# Altium schematic sheet cSLIM-SA_nRF9160.SchDoc: cSLIM v1 - nRF9160
size A3; SheetNumber: 2; SheetTotal: 12; Size: A3
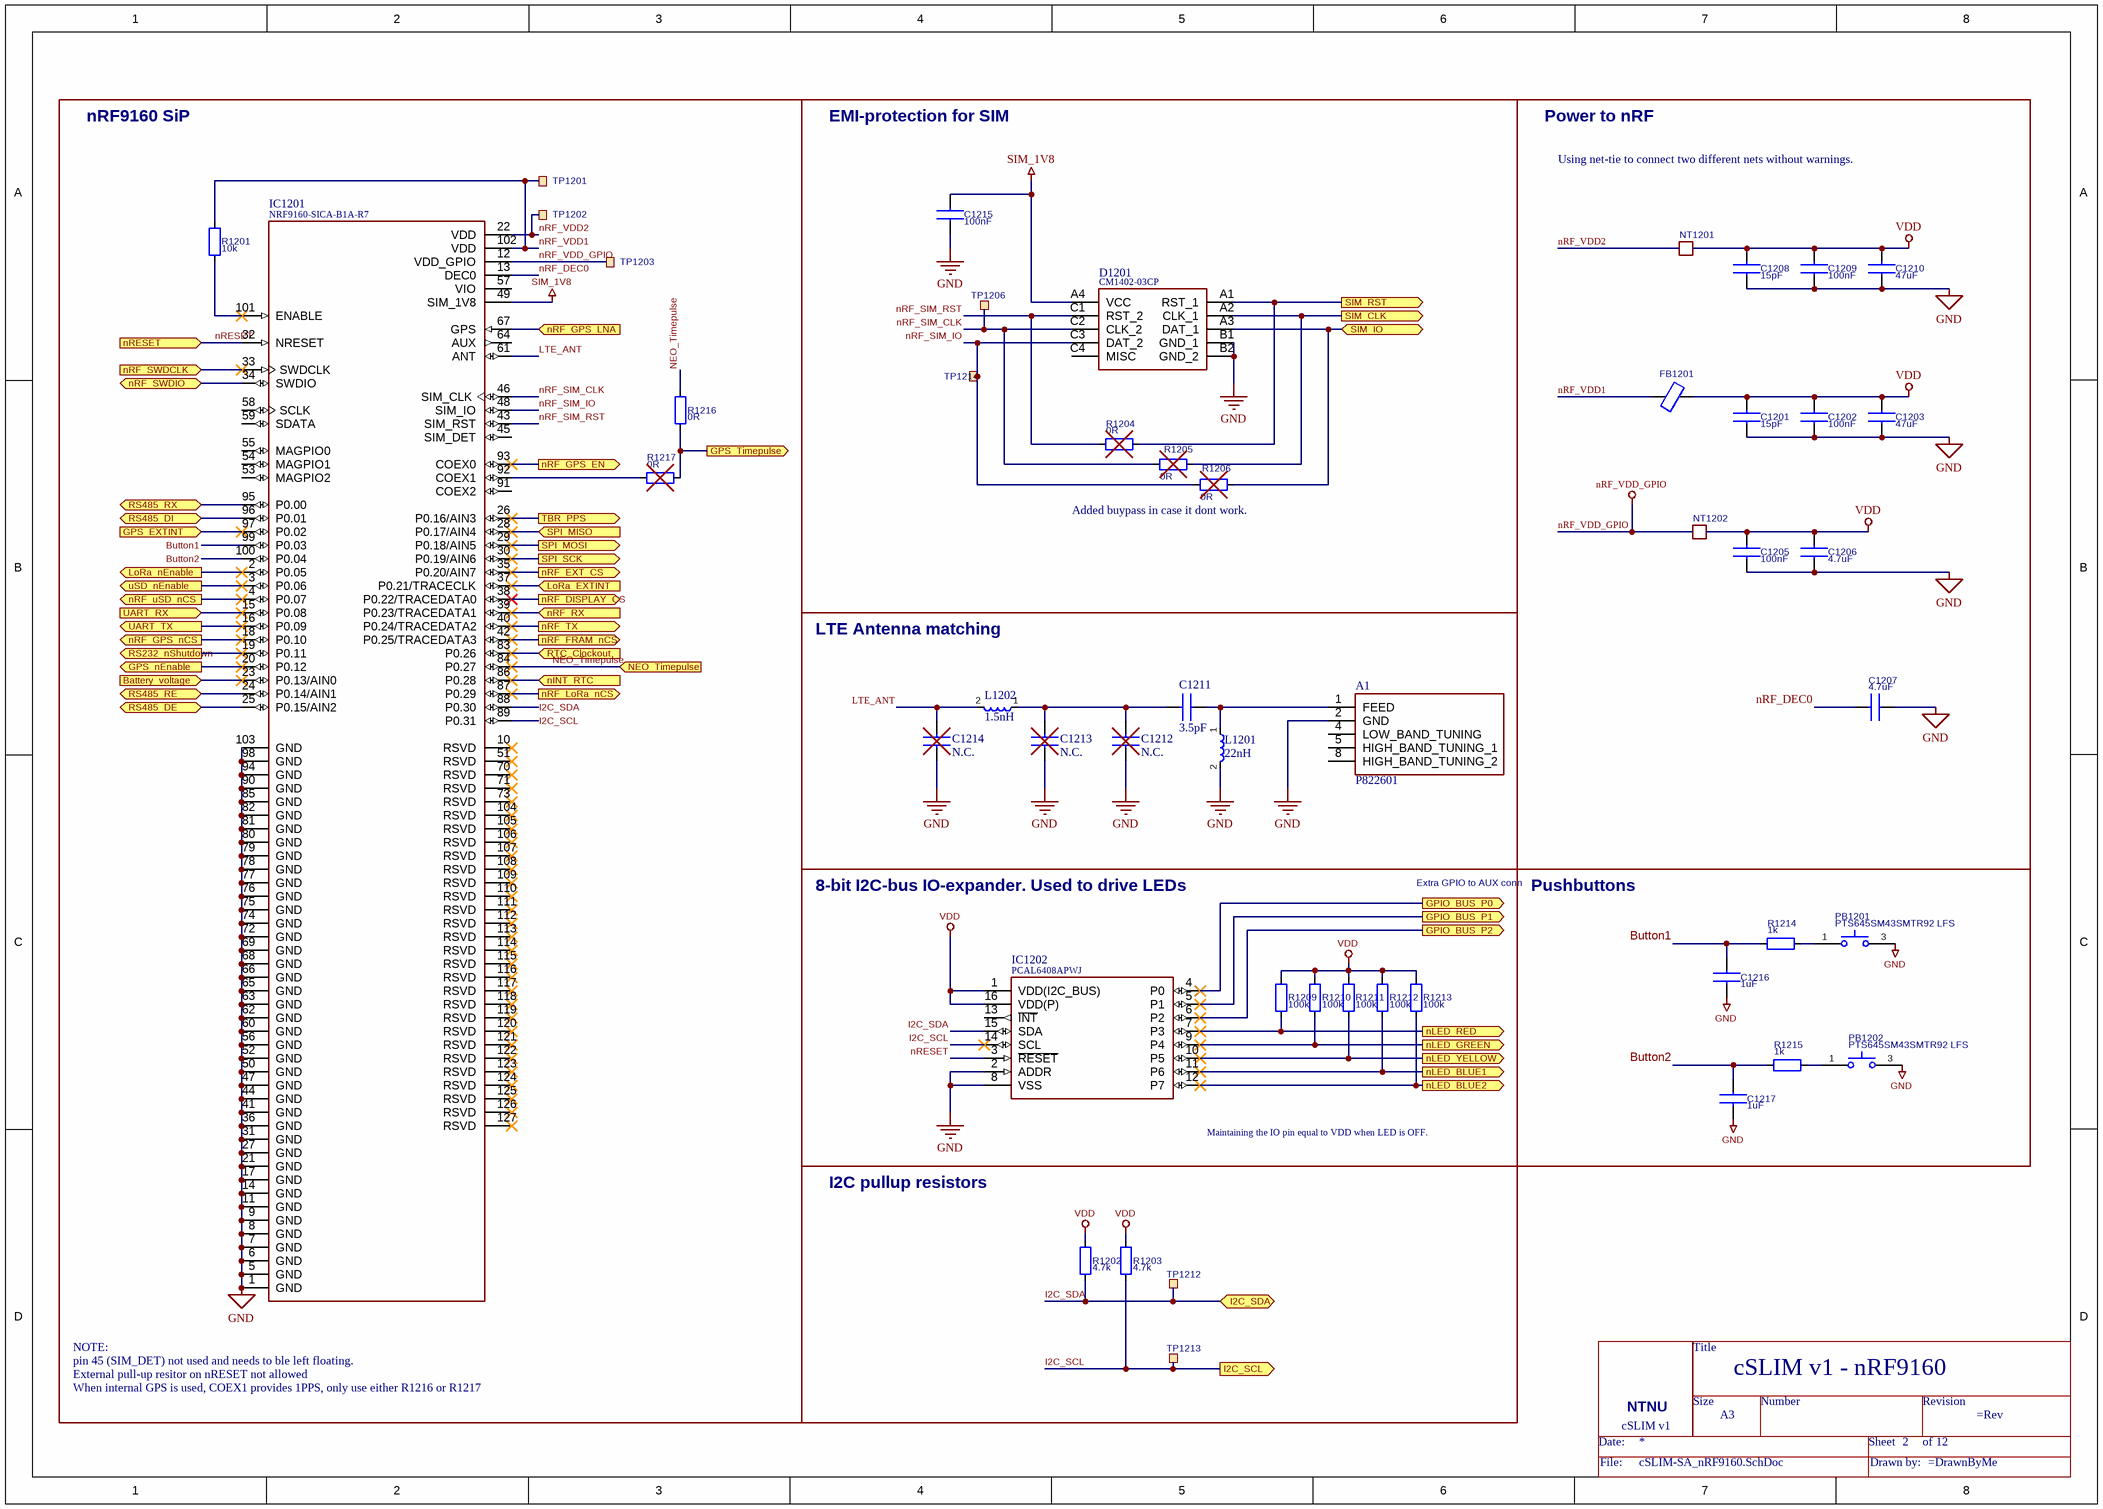
[diagram p0: cSLIM-SA_nRF9160.SchDoc]

## Parts
=DocumentName  Title_block  (value not drawn)  (no BOM)
A1  P822601  [P822601]
C1201  15pF  [CAPC1608X90N]
C1202  100nF  [CAPC1608X90N]
C1203  47uF  [CAPC1608X90N]
C1205  100nF  [CAPC1608X90N]
C1206  4.7uF  [CAPC1608X90N]
C1207  4.7uF  [CAPC1608X90N]
C1208  15pF  [CAPC1608X90N]
C1209  100nF  [CAPC1608X90N]
C1210  47uF  [CAPC1608X90N]
C1211  3.5pF  [CAPC1608X90N]
C1212  N.C.  [CAPC1608X90N]
C1213  N.C.  [CAPC1608X90N]
C1214  N.C.  [CAPC1608X90N]
C1215  100nF  [CAPC1608X90N]
C1216  1uF  [CAPC1608X90N]
C1217  1uF  [CAPC1608X90N]
D1201  CM1402-03CP  [CM140203CP]
FB1201  BLM18AG121SH1D  [CAPC1608X90N]  (value not drawn)
IC1201  NRF9160-SICA-B1A-R7  [XCVR_NRF9160-SICA-R7]
IC1202  PCAL6408APWJ  [SOP65P640X110-16N]
L1201  22nH  [L-1608]
L1202  1.5nH  [L-1608]
NT1201  NetTie  [NETTIE_FP]  (value not drawn)  (no BOM)
NT1202  NetTie  [NETTIE_FP]  (value not drawn)  (no BOM)
PB1201  PTS645SM43SMTR92 LFS  [PTS645(SMT)]
PB1202  PTS645SM43SMTR92 LFS  [PTS645(SMT)]
R1201  10k  [RESC1608X55N]
R1202  4.7k  [RESC1608X55N]
R1203  4.7k  [RESC1608X55N]
R1204  0R  [RESC1608X55N]
R1205  0R  [RESC1608X55N]
R1206  0R  [RESC1608X55N]
R1209  100k  [RESC1608X55N]
R1210  100k  [RESC1608X55N]
R1211  100k  [RESC1608X55N]
R1212  100k  [RESC1608X55N]
R1213  100k  [RESC1608X55N]
R1214  1k  [RESC1608X55N]
R1215  1k  [RESC1608X55N]
R1216  0R  [RESC1608X55N]
R1217  0R  [RESC1608X55N]
TP1201  TP  [TP_SMD_Ø1.0mm]  (value not drawn)  (no BOM)
TP1202  TP  [TP_SMD_Ø1.0mm]  (value not drawn)  (no BOM)
TP1203  TP  [TP_SMD_Ø1.0mm]  (value not drawn)  (no BOM)
TP1206  TP  [TP_SMD_Ø1.0mm]  (value not drawn)  (no BOM)
TP1212  TP  [TP_SMD_Ø1.0mm]  (value not drawn)  (no BOM)
TP1213  TP  [TP_SMD_Ø1.0mm]  (value not drawn)  (no BOM)
TP1214  TP  [TP_SMD_Ø1.0mm]  (value not drawn)  (no BOM)

## Blocks framed on the sheet
nRF9160 SiP: IC1201 R1201 R1216 R1217 TP1201-TP1203
EMI-protection for SIM: C1215 D1201 R1204-R1206 TP1206 TP1214
Power to nRF: C1201-C1203 C1205-C1210 FB1201 NT1201 NT1202
LTE Antenna matching: A1 C1211-C1214 L1201 L1202
8-bit I2C-bus IO-expander. Used to drive LEDs: IC1202 R1209-R1213
Pushbuttons: C1216 C1217 PB1201 PB1202 R1214 R1215
I2C pullup resistors: R1202 R1203 TP1212 TP1213

## Ports
Battery_voltage (in), GPIO_BUS_P0 (out), GPIO_BUS_P1 (out), GPIO_BUS_P2 (out), GPS_EXTINT (in), GPS_nEnable (out), GPS_Timepulse (out), I2C_SCL (out), I2C_SDA (bidir), LoRa_EXTINT (in), LoRa_nEnable (out), NEO_Timepulse (in), nINT_RTC (in), nLED_BLUE1 (out), nLED_BLUE2 (out), nLED_GREEN (out), nLED_RED (out), nLED_YELLOW (out), nRESET (in), nRF_DISPLAY_CS (out), nRF_EXT_CS (out), nRF_FRAM_nCS (out), nRF_GPS_EN (out), nRF_GPS_LNA (in), nRF_GPS_nCS (out), nRF_LoRa_nCS (out), nRF_RX (in), nRF_SWDCLK (in), nRF_SWDIO (bidir), nRF_TX (out), nRF_uSD_nCS (out), RS232_nShutdown (out), RS485_DE (bidir), RS485_DI (bidir), RS485_RE (bidir), RS485_RX (bidir), RTC_Clockout (in), SIM_CLK (out), SIM_IO (bidir), SIM_RST (out), SPI_MISO (in), SPI_MOSI (out), SPI_SCK (out), TBR_PPS (out), UART_RX (in), UART_TX (out), uSD_nEnable (out)

## Nets
GND: A1.2(GND) C1201.2 C1202.2 C1203.2 C1205.2 C1206.2 C1207.2 C1208.2 C1209.2 C1210.2 C1212.2 C1213.2 C1214.2 C1215.2 C1216.2 C1217.2 D1201.B1(GND_1) D1201.B2(GND_2) IC1201.1(GND) IC1201.5(GND) IC1201.6(GND) IC1201.7(GND) IC1201.8(GND) IC1201.9(GND) IC1201.11(GND) IC1201.14(GND) IC1201.17(GND) IC1201.21(GND) IC1201.27(GND) IC1201.31(GND) IC1201.36(GND) IC1201.41(GND) IC1201.44(GND) IC1201.47(GND) IC1201.50(GND) IC1201.52(GND) IC1201.56(GND) IC1201.60(GND) IC1201.62(GND) IC1201.63(GND) IC1201.65(GND) IC1201.66(GND) IC1201.68(GND) IC1201.69(GND) IC1201.72(GND) IC1201.74(GND) IC1201.75(GND) IC1201.76(GND) IC1201.77(GND) IC1201.78(GND) IC1201.79(GND) IC1201.80(GND) IC1201.81(GND) IC1201.82(GND) IC1201.85(GND) IC1201.90(GND) IC1201.94(GND) IC1201.98(GND) IC1201.103(GND) IC1202.2(ADDR) IC1202.8(VSS) L1201.2 PB1201.3 PB1202.3
nRF_VDD_GPIO: IC1201.12(VDD_GPIO) NT1202.1 TP1203.1
SIM_1V8: C1215.1 D1201.A4(VCC) IC1201.49(SIM_1V8)
VDD: C1201.1 C1202.1 C1203.1 C1205.1 C1206.1 C1208.1 C1209.1 C1210.1 FB1201.2 IC1202.1(VDD(I2C_BUS)) IC1202.16(VDD(P)) NT1201.2 NT1202.2 R1202.2 R1203.2 R1209.1 R1210.1 R1211.1 R1212.1 R1213.1
Battery_voltage: IC1201.23(P0.13/AIN0) ; port Battery_voltage
Button1: C1216.1 IC1201.99(P0.03) R1214.1
Button2: C1217.1 IC1201.100(P0.04) R1215.1
GPIO_BUS_P0: IC1202.4(P0) ; port GPIO_BUS_P0
GPIO_BUS_P1: IC1202.5(P1) ; port GPIO_BUS_P1
GPIO_BUS_P2: IC1202.6(P2) ; port GPIO_BUS_P2
GPS_EXTINT: IC1201.97(P0.02) ; port GPS_EXTINT
GPS_nEnable: IC1201.20(P0.12) ; port GPS_nEnable
GPS_Timepulse: R1216.2 R1217.2 ; port GPS_Timepulse
I2C_SCL: IC1201.89(P0.31) IC1202.14(SCL) R1203.1 TP1213.1 ; port I2C_SCL
I2C_SDA: IC1201.88(P0.30) IC1202.15(SDA) R1202.1 TP1212.1 ; port I2C_SDA
LoRa_EXTINT: IC1201.37(P0.21/TRACECLK) ; port LoRa_EXTINT
LoRa_nEnable: IC1201.2(P0.05) ; port LoRa_nEnable
LTE_ANT: C1214.1 IC1201.61(ANT) L1202.2
NEO_Timepulse: IC1201.84(P0.27) R1216.1 ; port NEO_Timepulse
nINT_RTC: IC1201.86(P0.28) ; port nINT_RTC
nLED_BLUE1: IC1202.11(P6) R1212.2 ; port nLED_BLUE1
nLED_BLUE2: IC1202.12(P7) R1213.2 ; port nLED_BLUE2
nLED_GREEN: IC1202.9(P4) R1210.2 ; port nLED_GREEN
nLED_RED: IC1202.7(P3) R1209.2 ; port nLED_RED
nLED_YELLOW: IC1202.10(P5) R1211.2 ; port nLED_YELLOW
nRESET: IC1201.32(NRESET) IC1202.3(~{RESET}) ; port nRESET
nRF_DEC0: C1207.1 IC1201.13(DEC0)
nRF_DISPLAY_CS: IC1201.38(P0.22/TRACEDATA0) ; port nRF_DISPLAY_CS
nRF_EXT_CS: IC1201.35(P0.20/AIN7) ; port nRF_EXT_CS
nRF_FRAM_nCS: IC1201.42(P0.25/TRACEDATA3) ; port nRF_FRAM_nCS
nRF_GPS_EN: IC1201.93(COEX0) ; port nRF_GPS_EN
nRF_GPS_LNA: IC1201.67(GPS) ; port nRF_GPS_LNA
nRF_GPS_nCS: IC1201.18(P0.10) ; port nRF_GPS_nCS
nRF_LoRa_nCS: IC1201.87(P0.29) ; port nRF_LoRa_nCS
nRF_RX: IC1201.39(P0.23/TRACEDATA1) ; port nRF_RX
nRF_SIM_CLK: D1201.C2(CLK_2) IC1201.46(SIM_CLK) R1205.1 TP1206.1
nRF_SIM_IO: D1201.C3(DAT_2) IC1201.48(SIM_IO) R1206.1 TP1214.1
nRF_SIM_RST: D1201.C1(RST_2) IC1201.43(SIM_RST) R1204.1
nRF_SWDCLK: IC1201.33(SWDCLK) ; port nRF_SWDCLK
nRF_SWDIO: IC1201.34(SWDIO) ; port nRF_SWDIO
nRF_TX: IC1201.40(P0.24/TRACEDATA2) ; port nRF_TX
nRF_uSD_nCS: IC1201.4(P0.07) ; port nRF_uSD_nCS
nRF_VDD1: FB1201.1 IC1201.102(VDD) R1201.1 TP1201.1
nRF_VDD2: IC1201.22(VDD) NT1201.1 TP1202.1
RS232_nShutdown: IC1201.19(P0.11) ; port RS232_nShutdown
RS485_DE: IC1201.25(P0.15/AIN2) ; port RS485_DE
RS485_DI: IC1201.96(P0.01) ; port RS485_DI
RS485_RE: IC1201.24(P0.14/AIN1) ; port RS485_RE
RS485_RX: IC1201.95(P0.00) ; port RS485_RX
RTC_Clockout: IC1201.83(P0.26) ; port RTC_Clockout
SIM_CLK: D1201.A2(CLK_1) R1205.2 ; port SIM_CLK
SIM_IO: D1201.A3(DAT_1) R1206.2 ; port SIM_IO
SIM_RST: D1201.A1(RST_1) R1204.2 ; port SIM_RST
SPI_MISO: IC1201.28(P0.17/AIN4) ; port SPI_MISO
SPI_MOSI: IC1201.29(P0.18/AIN5) ; port SPI_MOSI
SPI_SCK: IC1201.30(P0.19/AIN6) ; port SPI_SCK
TBR_PPS: IC1201.26(P0.16/AIN3) ; port TBR_PPS
UART_RX: IC1201.15(P0.08) ; port UART_RX
UART_TX: IC1201.16(P0.09) ; port UART_TX
uSD_nEnable: IC1201.3(P0.06) ; port uSD_nEnable
NetA1_1: A1.1(FEED) C1211.2 L1201.1
NetC1211_1: C1211.1 C1212.1 C1213.1 L1202.1
NetIC1201_92: IC1201.92(COEX1) R1217.1
NetIC1201_101: IC1201.101(ENABLE) R1201.2
NetPB1201_1: PB1201.1 R1214.2
NetPB1202_1: PB1202.1 R1215.2

Not connected (* = marked no-connect by the designer): A1 4(LOW_BAND_TUNING) 5(HIGH_BAND_TUNING_1) 8(HIGH_BAND_TUNING_2); D1201 C4(MISC); IC1201 10(RSVD)* 45(SIM_DET) 51(RSVD)* 53(MAGPIO2) 54(MAGPIO1) 55(MAGPIO0) 57(VIO) 58(SCLK) 59(SDATA) 64(AUX) 70(RSVD)* 71(RSVD)* 73(RSVD)* 91(COEX2) 104(RSVD)* 105(RSVD)* 106(RSVD)* 107(RSVD)* 108(RSVD)* 109(RSVD)* 110(RSVD)* 111(RSVD)* 112(RSVD)* 113(RSVD)* 114(RSVD)* 115(RSVD)* 116(RSVD)* 117(RSVD)* 118(RSVD)* 119(RSVD)* 120(RSVD)* 121(RSVD)* 122(RSVD)* 123(RSVD)* 124(RSVD)* 125(RSVD)* 126(RSVD)* 127(RSVD)*; IC1202 13(~{INT})

## Notes on the sheet
- Using net-tie to connect two different nets without warnings.
- (near R1206) Added buypass in case it dont work.
- Extra GPIO to AUX conn
- Maintaining the IO pin equal to VDD when LED is OFF.
- NOTE:
- pin 45 (SIM_DET) not used and needs to ble left floating.
- External pull-up resitor on nRESET not allowed
- When internal GPS is used, COEX1 provides 1PPS, only use either R1216 or R1217
- THIS DOCUMENT AND THE DATA DISCLOSED HEREIN OR
- HEREWITH IS THE PROPERTY OF ALTIUM LIMITED AND MAY
- DWG NO:
- REVISION
- REV:
- DESCRIPTION
- DATE
- APPROVED
- BE FREELY DISTRIBUTED IN WHOLE. NO RIGHTS ARE
- RESERVED OR EXPRESS OR IMPLIED WARANTEE GIVEN.
- ENG:
- APPROVALS
- PROJECT
- DSN:
- CHK:
- REFERENCE DOCUMENTS
- PROJECT REVISION:
- TITLE
- DOCUMENT REVISION:
- DESIGN ITEM:
- BOM:
- FAB DWG:
- PCB DWG:
- ASSY DWG:
- SCALE:
- A3
- SIZE
- CAGE CODE
- FILE NAME
- DWG NO.
- SHEET
- OF
- REV
- (in symbol Title_block) Title; Size; Number; Revision; NTNU; cSLIM v1; Date:; Sheet; of; File:; Drawn by:

## Library data of the parts
A1 = P822601: 700MHz, 750MHz, 850MHz, 900MHz, 1.8GHz, 1.9GHz, 2.1GHz, 2.7GHz CDMA, DCS, EDGE, GPRS, GSM, HSDPA, LTE, PCS, UMTS, WCDMA Flat Bar RF Antenna; Manufacturer_Name: AVX; Datasheet Link: http://datasheets.avx.com/ethertronics/AVX-E_P822601-P822602.pdf; Height: 3.5mm; Manufacturer_Part_Number: P822601; Mouser Part Number: 581-P822601; Mouser Price/Stock: https://www.mouser.co.uk/ProductDetail/AVX/P822601?qs=vdi0iO8H4N0igrTLYxGIXg%3D%3D; Arrow Part Number: P822601; Arrow Price/Stock: https://www.arrow.com/en/products/p822601/avx?region=nac
C1201 C1208 = C: Capacitor; Manufacturer_Part_Number: CL10C150JB81PNC; Fitted: Yes; value: 15pF
C1202 C1205 C1209 C1215 = C: Capacitor; Manufacturer_Part_Number: CL10B104KB8NNNL; Fitted: Yes; value: 100nF
C1203 C1210 = C: Capacitor; Manufacturer_Part_Number: GRM188D70E476ME01D; Fitted: Yes; value: 47uF
C1206 C1207 = C: Capacitor; Manufacturer_Part_Number: CL10A475KQ8NNNC; Fitted: Yes; value: 4.7uF
C1211 = C: Capacitor; Manufacturer_Part_Number: CL10C3R3CB81PNC; Fitted: Yes; value: 3.5pF
C1212-C1214 = C: Capacitor; Fitted: No; Manufacturer_Part_Number: *; value: N.C.
C1216 C1217 = C: Capacitor; Manufacturer_Part_Number: CL10A105KO8NNNC; Fitted: Yes; value: 1uF
D1201 = CM1402-03CP: FILTER RC(PI) ESD SMD; Manufacturer_Name: ON Semiconductor; Fitted: Yes; Datasheet Link: https://www.onsemi.com/pub/Collateral/CM1402-D.PDF; Height: 0.72mm; Manufacturer_Part_Number: CM1402-03CP; Mouser Part Number: 748-CM1402-03CP; Mouser Price/Stock: https://www.mouser.co.uk/ProductDetail/onsemi/CM1402-03CP?qs=lLuKAerq7nnG203YjtyI%252BA%3D%3D; Arrow Part Number: CM1402-03CP; Arrow Price/Stock: https://www.arrow.com/en/products/cm1402-03cp/on-semiconductor
FB1201 = Ferrite_Bead: Ferrite bead - 120ohm 0.7A; Manufacturer_Part_Number: BLM18AG121SH1D; value: 120ohm 0.7A
IC1201 = NRF9160-SICA-R7: IC RF TxRx + MCU Cellular GPS 700MHz ~ 2.2GHz 161-TFLGA Module; MF: Nordic Semiconductor ASA; Fitted: Yes; Purchase-URL: https://pricing.snapeda.com/search/part/NRF9160-SICA-R7/?ref=eda; Availability: Good; Price: None; Package: Module Nordic Semiconductor ASA; Value: *; SnapEDA_Link: https://www.snapeda.com/parts/NRF9160-SICA-R7/Nordic%20Semiconductor%20ASA/view-part/3660917/?ref=snap; MP: NRF9160-SICA-R7; Manufacturer_Part_Number: NRF9160-SICA-R7
IC1202 = PCAL6408APWJ: I/O Expander 8 I2C, SMBus 400 kHz 16-TSSOP; Manufacturer_Name: NXP; Fitted: Yes; Datasheet Link: http://www.nxp.com/docs/en/data-sheet/PCAL6408A.pdf; Height: 1.1mm; Manufacturer_Part_Number: PCAL6408APWJ; Mouser Part Number: 771-PCAL6408APWJ; Mouser Price/Stock: https://www.mouser.co.uk/ProductDetail/NXP-Semiconductors/PCAL6408APWJ?qs=1sbE9T7hb3ayrs2xEWMTlg%3D%3D; Arrow Part Number: PCAL6408APWJ; Arrow Price/Stock: https://www.arrow.com/en/products/pcal6408apwj/nxp-semiconductors
L1201 = L: Manufacturer_Part_Number: LQW18AN22NJ00D; Fitted: Yes; value: 22nH
L1202 = L: Manufacturer_Part_Number: LQG18HN1N5S00D; Fitted: Yes; value: 1.5nH
PB1201 PB1202 = PTS645SM43SMTR92LFS: SWITCH TACTILE SPST-NO 0.05A 12V -  used 1-3 (2-4 not in use); Manufacturer_Name: C & K COMPONENTS; Manufacturer_Part_Number: TLS A 070J LFS; Description_: Tactile Switches Top actuated tact, 0.9 mm travel, 7 N, 50% Tactile, J Leads, SMT, 8.6 x 8.4 x 3.95 mm, Soft Actuator; Fitted: Yes; Footprint: TLSA070JLFS; Supplier: https://www.mouser.ph/datasheet/2/60/tls-1846606.pdf; Mouser Part Number: 611-TLSA070JLFS; Mouser Price/Stock: https://www.mouser.co.uk/ProductDetail/CK/TLS-A-070J-LFS?qs=GedFDFLaBXEdAqJ422mDcw%3D%3D
R1201 = R: Manufacturer_Part_Number: RC0603FR-0710KL; Fitted: Yes; value: 10k
R1202 R1203 = R: Manufacturer_Part_Number: RC0603FR-074K7L; Fitted: Yes; value: 4.7k
R1204-R1206 R1217 = R: Manufacturer_Part_Number: YJP1608-R001; Fitted: No; value: 0R
R1209-R1213 = R: Manufacturer_Part_Number: RC0603FR-07100KL; Fitted: Yes; value: 100k
R1214 R1215 = R: Manufacturer_Part_Number: RC0603FR-071KL; Fitted: Yes; value: 1k
R1216 = R: Manufacturer_Part_Number: YJP1608-R001; Fitted: Yes; value: 0R
TP1201-TP1203 TP1206 TP1212-TP1214 = TP: Test points